# EAGLE design MOD_IO_Rev_A1 (EAGLE 6.4)
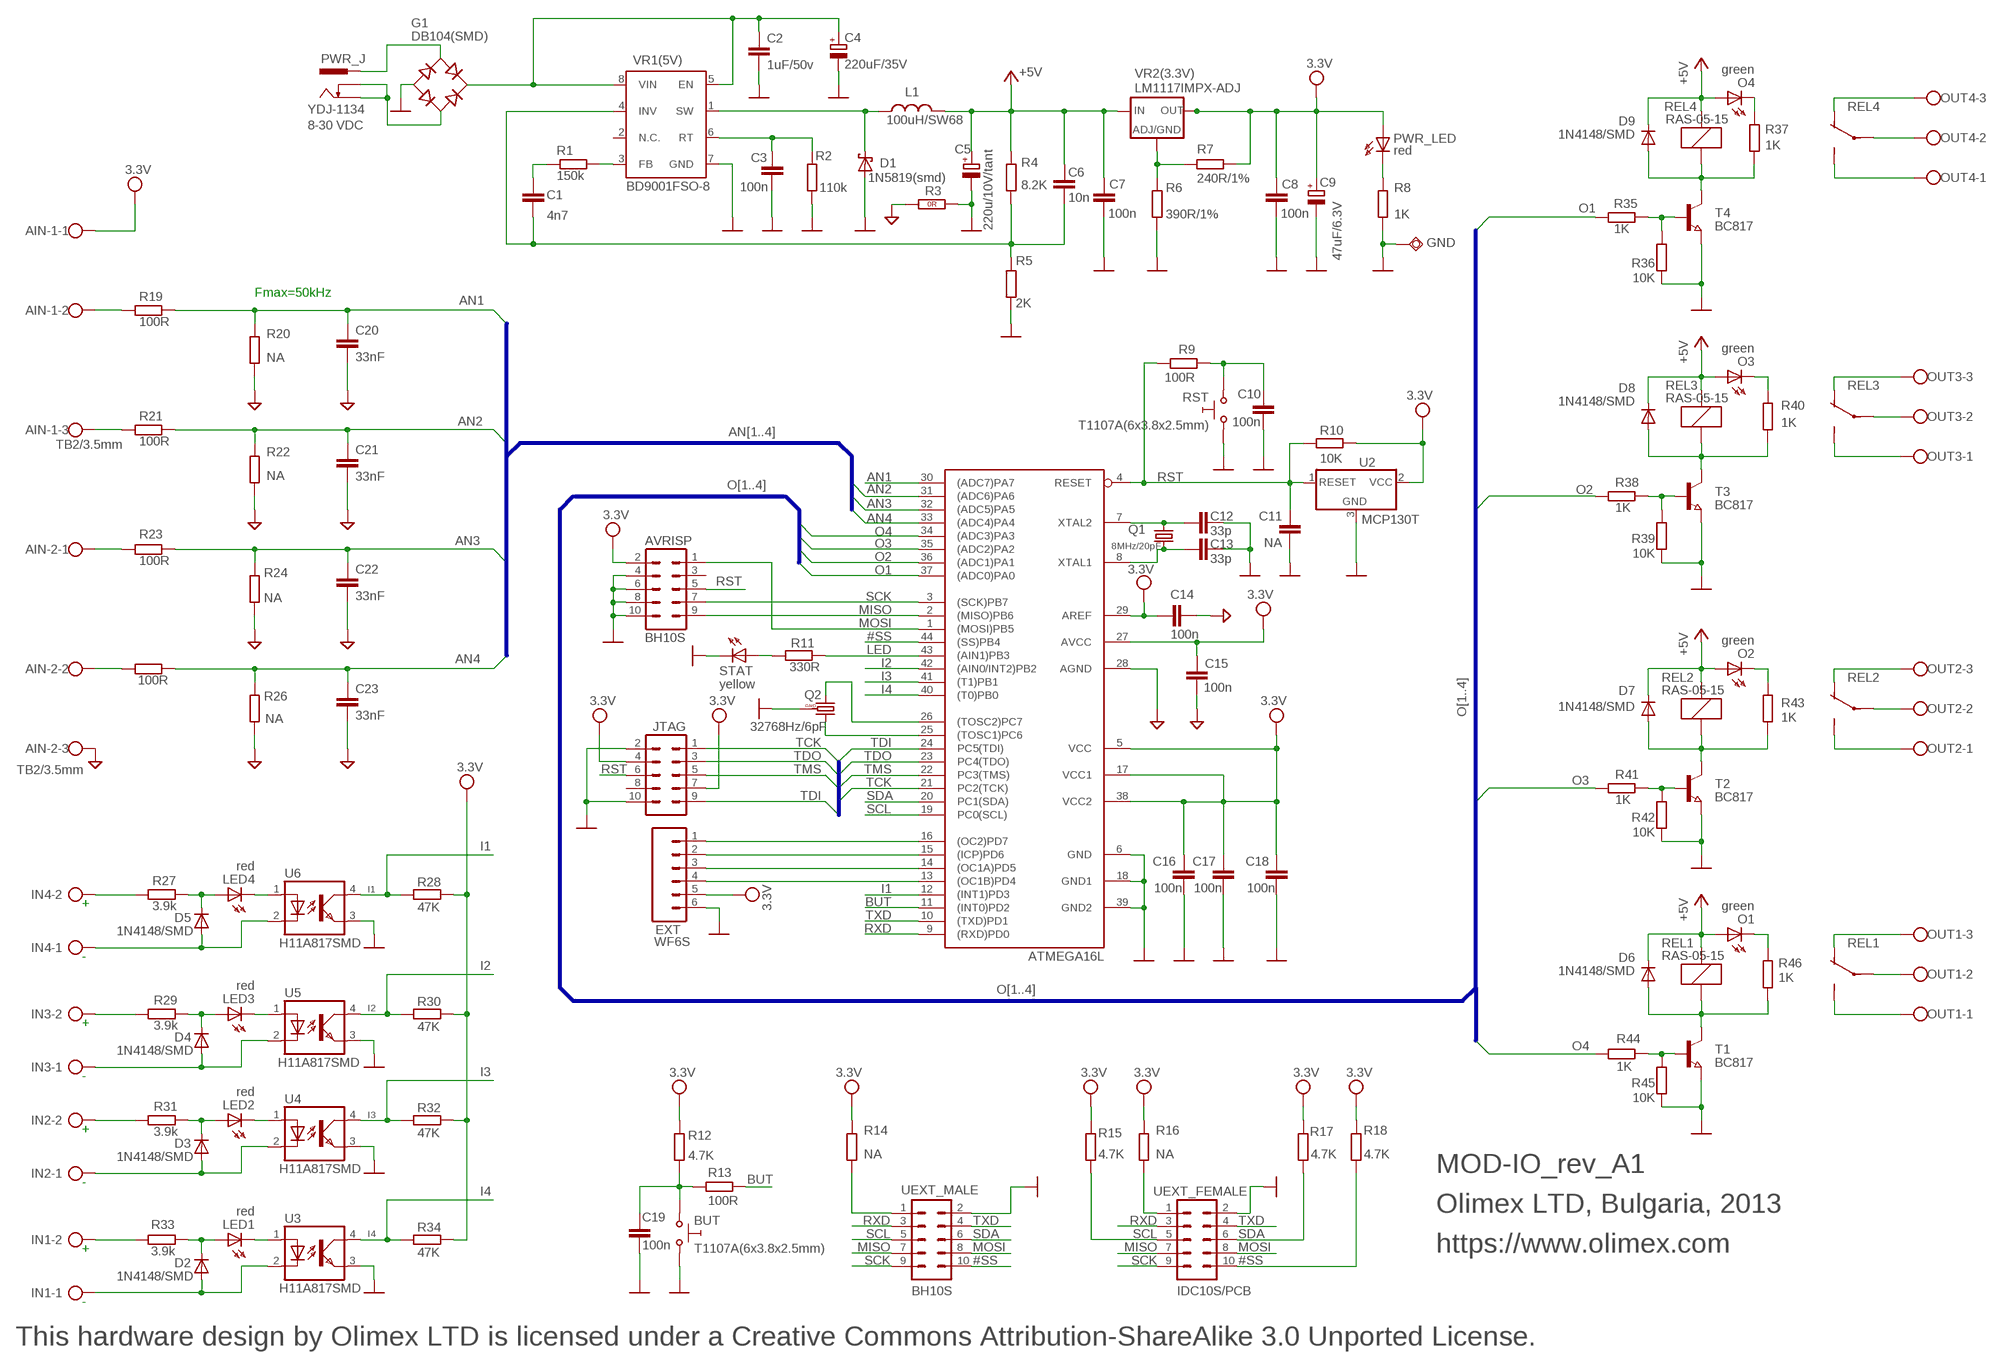
[diagram p0: schematic, sheet 1]

## Parts
AIN-1  TB2/3.5mm  W237-1034  [CON3-3.5MM]
AIN-2  TB2/3.5mm  W237-1034  [CON3-3.5MM]
AVRISP  BH10S  AVRICSP2  [CON2X5_SS2]
BUT  T1107A(6x3.8x2.5mm)  SW-TAKT6  [SW-TAKT_6X3.5_SMD]
C1  4n7  C06  [C0603]
C2  1uF/50v  C-EUC0805  [C0805]
C3  100n  C-EUC0603  [C0603]
C4  220uF/35V  CPOL-EUE3.5-8  [E3,5-8]
C5  220u/10V/tant  CPOL-EUCT7343  [CT7343]
C6  10n  C-EUC0603  [C0603]
C7  100n  C-EUC0603  [C0603]
C8  100n  C-EUC0603  [C0603]
C9  47uF/6.3V  CPOL-EUCT3528  [CT3528]
C10  100n  C-EUC0603  [C0603]
C11  NA  C-EUC0603  [C0603]
C12  33p  C-EUC0603  [C0603]
C13  33p  C-EUC0603  [C0603]
C14  100n  C-EUC0603  [C0603]
C15  100n  C-EUC0603  [C0603]
C16  100n  C-EUC0603  [C0603]
C17  100n  C-EUC0603  [C0603]
C18  100n  C-EUC0603  [C0603]
C19  100n  C-EUC0603  [C0603]
C20  33nF  C-EUC0603  [C0603]
C21  33nF  C-EUC0603  [C0603]
C22  33nF  C-EUC0603  [C0603]
C23  33nF  C-EUC0603  [C0603]
D1  1N5819(smd)  SCHOTKKY7.62SS2  [MLL-41]
D2  1N4148/SMD  DIODE-SOD80C  [SOD80C]
D3  1N4148/SMD  DIODE-SOD80C  [SOD80C]
D4  1N4148/SMD  DIODE-SOD80C  [SOD80C]
D5  1N4148/SMD  DIODE-SOD80C  [SOD80C]
D6  1N4148/SMD  DIODE-SOD80C  [SOD80C]
D7  1N4148/SMD  DIODE-SOD80C  [SOD80C]
D8  1N4148/SMD  DIODE-SOD80C  [SOD80C]
D9  1N4148/SMD  DIODE-SOD80C  [SOD80C]
EXT  WF6S  CON6PV6-2.54MM  [CON2.54MM-6-0]
G1  DB104(SMD)  B-DIL3  [DB104_SMD]
GND  TESTPAD40/70  [TESTPAD]
IN1  TB2/5MM  W237-102  [W237-102]
IN2  TB2/5MM  W237-102  [W237-102]
IN3  TB2/5MM  W237-102  [W237-102]
IN4  TB2/5MM  W237-102  [W237-102]
JTAG  BH10S  AVRICSP2  [CON2X5_SS2]
L1  100uH/SW68  LSW45  [SW68]
LED1  red  LED0805DWS  [LED-0805]
LED2  red  LED0805DWS  [LED-0805]
LED3  red  LED0805DWS  [LED-0805]
LED4  red  LED0805DWS  [LED-0805]
O1  green  LED0805DWS  [LED-0805]
O2  green  LED0805DWS  [LED-0805]
O3  green  LED0805DWS  [LED-0805]
O4  green  LED0805DWS  [LED-0805]
OUT1  TB3/5MM  W237-103  [W237-103]
OUT2  TB3/5MM  W237-103  [W237-103]
OUT3  TB3/5MM  W237-103  [W237-103]
OUT4  TB3/5MM  W237-103  [W237-103]
PWR_J  YDJ-1134  PWR-JAK3  [PWR_JACK_UNI]
PWR_LED  red  LED0805DWS  [LED-0805]
Q1  8MHz/20pF  HC49/S1  [HC49/SMD2_THIN]
Q2  32768Hz/6pF  Q_GND  [TC26H_3_REPAIR]
R1  150k  R-EU_R0603  [R0603]
R2  110k  R-EU_R0603  [R0603]
R3  R_0R0R(NA)  [0603_0R]
R4  8.2K  R-EU_R0603  [R0603]
R5  2K  R-EU_R0603  [R0603]
R6  390R/1%  R-EU_R0603  [R0603]
R7  240R/1%  R-EU_R0603  [R0603]
R8  1K  R-EU_R0603  [R0603]
R9  100R  R-EU_R0603  [R0603]
R10  10K  R-EU_R0603  [R0603]
R11  330R  R-EU_R0603  [R0603]
R12  4.7K  R-EU_R0603  [R0603]
R13  100R  R-EU_R0603  [R0603]
R14  NA  R-EU_NA  [R0603_NA]
R15  4.7K  R-EU_R0603  [R0603]
R16  NA  R-EU_NA  [R0603_NA]
R17  4.7K  R-EU_R0603  [R0603]
R18  4.7K  R-EU_R0603  [R0603]
R19  100R  R-EU_R0603  [R0603]
R20  NA  R-EU_NA  [R0603_NA]
R21  100R  R-EU_R0603  [R0603]
R22  NA  R-EU_NA  [R0603_NA]
R23  100R  R-EU_R0603  [R0603]
R24  NA  R-EU_NA  [R0603_NA]
R25  100R  R-EU_R0603  [R0603]
R26  NA  R-EU_NA  [R0603_NA]
R27  3.9k  R-EU_R0603  [R0603]
R28  47K  R-EU_R0603  [R0603]
R29  3.9k  R-EU_R0603  [R0603]
R30  47K  R-EU_R0603  [R0603]
R31  3.9k  R-EU_R0603  [R0603]
R32  47K  R-EU_R0603  [R0603]
R33  3.9k  R-EU_R0603  [R0603]
R34  47K  R-EU_R0603  [R0603]
R35  1K  R-EU_R0603  [R0603]
R36  10K  R-EU_R0603  [R0603]
R37  1K  R-EU_R0603  [R0603]
R38  1K  R-EU_R0603  [R0603]
R39  10K  R-EU_R0603  [R0603]
R40  1K  R-EU_R0603  [R0603]
R41  1K  R-EU_R0603  [R0603]
R42  10K  R-EU_R0603  [R0603]
R43  1K  R-EU_R0603  [R0603]
R44  1K  R-EU_R0603  [R0603]
R45  10K  R-EU_R0603  [R0603]
R46  1K  R-EU_R0603  [R0603]
REL1  RAS-05-15  RELAYH200F  [H200-FAT]
REL2  RAS-05-15  RELAYH200F  [H200-FAT]
REL3  RAS-05-15  RELAYH200F  [H200-FAT]
REL4  RAS-05-15  RELAYH200F  [H200-FAT]
RST  T1107A(6x3.8x2.5mm)  SW-TAKT6  [SW-TAKT_6X3.5_SMD]
STAT  yellow  LED0805DWS  [LED-0805]
T1  BC817  NPN-TRANSISTOR_SOT23  [SOT23]
T2  BC817  NPN-TRANSISTOR_SOT23  [SOT23]
T3  BC817  NPN-TRANSISTOR_SOT23  [SOT23]
T4  BC817  NPN-TRANSISTOR_SOT23  [SOT23]
U1  ATMEGA16L  ATMEGA16  [44TQFP]
U2  MCP130T  RESETMCP130T-300-I/TT  [SOT23]
U3  H11A817SMD  [OPTOCOUPLER_SMD4PIN]
U4  H11A817SMD  [OPTOCOUPLER_SMD4PIN]
U5  H11A817SMD  [OPTOCOUPLER_SMD4PIN]
U6  H11A817SMD  [OPTOCOUPLER_SMD4PIN]
UEXT_FEMALE  IDC10S/PCB  ML10SMD_1  [ML10L_PADS_FEMAIL]
UEXT_MALE  BH10S  ML10SMD  [ML10_PADS]
VR1(5V)  BD9001FSO-8  [SO-8]
VR2(3.3V)  LM1117IMPX-ADJ  LM1117  [SOT223]

## Nets
#SS: R18.1 U1.44((SS)PB4) UEXT_FEMALE.10 UEXT_MALE.10
+5V: C5.+ C6.1 C7.2 D6.C D7.C D8.C D9.C L1.2 O1.A O2.A O3.A O4.A R4.1 REL1.1 REL2.1 REL3.1 REL4.1 VR2(3.3V).3(IN)
AGND: AIN-2.3 C14.2 C15.1 C20.2 C21.2 C22.2 C23.2 R3.1(1.1) R20.1 R22.1 R24.1 R26.1 U1.28(AGND)
AN1: C20.1 R19.2 R20.2 U1.30((ADC7)PA7)
AN2: C21.1 R21.2 R22.2 U1.31((ADC6)PA6)
AN3: C22.1 R23.2 R24.2 U1.32((ADC5)PA5)
AN4: C23.1 R25.1 R26.2 U1.33((ADC4)PA4)
BUT: R13.2 U1.11((INT0)PD2)
GND [pwr1]: AVRISP.4 AVRISP.6 AVRISP.8 AVRISP.10 BUT.P$1 C2.2 C3.1 C4.- C5.- C7.1 C8.1 C9.- C10.2 C11.2 C12.1 C13.1 C16.2 C17.2 C18.2 C19.2 D1.A EXT.6 G1.- GND.P$1(PP) JTAG.2 JTAG.10 Q2.GND R2.2 R3.2(1.2) R5.2 R6.2 R8.2 R36.1 R39.1 R42.1 R45.1 RST.P$1 STAT.C T1.2(E) T2.2(E) T3.2(E) T4.2(E) U1.6(GND) U1.18(GND1) U1.39(GND2) U2.3(GND) U3.3(EMI) U4.3(EMI) U5.3(EMI) U6.3(EMI) UEXT_FEMALE.2 UEXT_MALE.2 VR1(5V).7(GND)
I1: R28.1 U1.12((INT1)PD3) U6.4(COL)
I2: R30.1 U1.42((AIN0/INT2)PB2) U5.4(COL)
I3: R32.1 U1.41((T1)PB1) U4.4(COL)
I4: R34.1 U1.40((T0)PB0) U3.4(COL)
LED: R11.1 U1.43((AIN1)PB3)
MISO: AVRISP.9 U1.2((MISO)PB6) UEXT_FEMALE.7 UEXT_MALE.7
MOSI: AVRISP.1 U1.1((MOSI)PB5) UEXT_FEMALE.8 UEXT_MALE.8
N$1: BUT.P$2 C19.1 R12.2 R13.1
N$2 [pwr1]: R16.1 UEXT_FEMALE.1
N$3: OUT2.2 REL2.P(CONTACTS:P)
N$4: OUT2.1 REL2.S(CONTACTS:S)
N$5 [rel]: OUT4.3 REL4.O(CONTACTS:O)
N$6: OUT1.2 REL1.P(CONTACTS:P)
N$7: OUT1.1 REL1.S(CONTACTS:S)
N$8: IN4.2 R27.1
N$9: IN3.2 R29.1
N$10: IN2.2 R31.1
N$11: IN1.2 R33.1
N$12 [pwr1]: R14.1 UEXT_MALE.1
N$13: EXT.1 U1.16((OC2)PD7)
N$14: C10.1 R9.1 RST.P$2
N$18: OUT4.2 REL4.P(CONTACTS:P)
N$19: OUT4.1 REL4.S(CONTACTS:S)
N$20: R35.2 R36.2 T4.1(B)
N$21 [rel]: OUT3.3 REL3.O(CONTACTS:O)
N$22 [pwr2]: D9.A R37.1 REL4.2 T4.3(C)
N$23: OUT3.2 REL3.P(CONTACTS:P)
N$24: OUT3.1 REL3.S(CONTACTS:S)
N$25: R38.2 R39.2 T3.1(B)
N$26: O4.C R37.2
N$27: O3.C R40.2
N$28: C12.2 Q1.2 U1.7(XTAL2)
N$29 [rel]: OUT2.3 REL2.O(CONTACTS:O)
N$30: EXT.2 U1.15((ICP)PD6)
N$31: EXT.3 U1.14((OC1A)PD5)
N$32: R41.2 R42.2 T2.1(B)
N$33: O1.C R46.2
N$34 [pwr2]: D8.A R40.1 REL3.2 T3.3(C)
N$35: EXT.4 U1.13((OC1B)PD4)
N$37: OUT1.3 REL1.O(CONTACTS:O)
N$38: R44.2 R45.2 T1.1(B)
N$39: C1.1 C6.2 R4.2 R5.1 VR1(5V).4(INV)
N$40: O2.C R43.2
N$43 [pwr2]: D7.A R43.1 REL2.2 T2.3(C)
N$44 [pwr2]: D6.A R46.1 REL1.2 T1.3(C)
N$46: R1.1 VR1(5V).3(FB)
N$47: R11.2 STAT.A
N$48: G1.AC1 PWR_J.- PWR_J.--
N$50: G1.AC2 PWR_J.+
N$52: AIN-1.2 R19.1
N$53: C13.2 Q1.1 U1.8(XTAL1)
N$55: AIN-2.2 R25.2
N$56: C1.2 R1.2
N$57: R6.1 R7.1 VR2(3.3V).1(ADJ/GND)
N$58: AIN-1.3 R21.1
N$59: PWR_LED.C R8.1
N$60: AIN-2.1 R23.1
N$61: C2.1 C4.+ G1.+ VR1(5V).5(EN) VR1(5V).8(VIN)
N$62: C3.2 R2.1 VR1(5V).6(RT)
N$63: D4.A IN3.1 U5.2(C)
N$65: LED3.C U5.1(A)
N$66: D5.C LED4.A R27.2
N$67: D5.A IN4.1 U6.2(C)
N$69 [pwr1]: D1.K(C) L1.1 VR1(5V).1(SW)
N$70: LED4.C U6.1(A)
N$71: D4.C LED3.A R29.2
N$72: D2.A IN1.1 U3.2(C)
N$73: Q2.1 U1.26((TOSC2)PC7)
N$74: LED1.C U3.1(A)
N$75: D3.C LED2.A R31.2
N$76: D3.A IN2.1 U4.2(C)
N$77: Q2.2 U1.25((TOSC1)PC6)
N$78: LED2.C U4.1(A)
N$79: D2.C LED1.A R33.2
O1: R35.1 U1.37((ADC0)PA0)
O2: R38.1 U1.36((ADC1)PA1)
O3: R41.1 U1.35((ADC2)PA2)
O4: R44.1 U1.34((ADC3)PA3)
RST: AVRISP.5 C11.1 JTAG.6 R9.2 R10.2 U1.4(RESET) U2.1(RESET)
RXD: U1.9((RXD)PD0) UEXT_FEMALE.3 UEXT_MALE.3
SCK: AVRISP.7 U1.3((SCK)PB7) UEXT_FEMALE.9 UEXT_MALE.9
SCL: R15.1 U1.19(PC0(SCL)) UEXT_FEMALE.5 UEXT_MALE.5
SDA: R17.1 U1.20(PC1(SDA)) UEXT_FEMALE.6 UEXT_MALE.6
TCK: JTAG.1 U1.21(PC2(TCK))
TDI: JTAG.9 U1.24(PC5(TDI))
TDO: JTAG.3 U1.23(PC4(TDO))
TMS: JTAG.5 U1.22(PC3(TMS))
TXD: U1.10((TXD)PD1) UEXT_FEMALE.4 UEXT_MALE.4
VCC [pwr1]: AIN-1.1 AVRISP.2 C8.2 C9.+ C14.1 C15.2 C16.1 C17.1 C18.1 EXT.5 JTAG.4 JTAG.7 PWR_LED.A R7.2 R10.1 R12.1 R14.2 R15.2 R16.2 R17.2 R18.2 R28.2 R30.2 R32.2 R34.2 U1.5(VCC) U1.17(VCC1) U1.27(AVCC) U1.29(AREF) U1.38(VCC2) U2.2(VCC) VR2(3.3V).2(OUT) VR2(3.3V).4(RAD) ; supply symbol labelled 3.3V
Unconnected: AVRISP.3 JTAG.8 VR1(5V).2(N.C.)

## Buses
AN[1..4]
O[1..4]
PC[0..7]

## Notes on the sheet
- 8-30 VDC
- Fmax=50kHz
- +
- -
- +
- -
- +
- MOD-IO_rev_A1
- -
- Olimex LTD, Bulgaria, 2013
- + | https://www.olimex.com
- -
- This hardware design by Olimex LTD is licensed under a Creative Commons Attribution-ShareAlike 3.0 Unported License.

## Library data of the parts
AIN-1 AIN-2 OUT1-OUT4 = con-wago-500:W237-103: WAGO SCREW CLAMP
AVRISP JTAG = gogo:AVRICSP
BUT RST = gogo:SW-TAKT
C1 = DOUBLE-SIDE:C: Capacitor
C2 C3 C6-C8 C10-C23 = rcl:C-EU: CAPACITOR, European symbol
C4 C5 C9 = rcl:CPOL-EU: POLARIZED CAPACITOR, European symbol
D1 = gogo:SCHOTKKY7.62SS
D2-D9 = diode:DIODE-: DIODE
EXT = DOUBLE-SIDE:CON6: CONNECTORS - 6 PINS
G1 = DOUBLE-SIDE:B-DIL: RECTIFIER
GND = gogo:TESTPAD: drill 40mils, diameter 70mils
IN1-IN4 = con-wago-500:W237-102: WAGO SCREW CLAMP
L1 = SINGLE-SIDE:L
LED1-LED4 O1-O4 PWR_LED STAT = DOUBLE-SIDE:LED
PWR_J = gogo:PWR-JAK
Q1 = crystal:HC49/S: CRYSTAL
Q2 = crystal:Q_GND
R1 R2 R4-R46 = rcl:R-EU_: RESISTOR, European symbol
R3 = OLIMEX_DISCRET:R_0R
REL1-REL4 = SINGLE-SIDE:RELAY: RELAY
T1-T4 = semicon-smd-ipc:NPN-TRANSISTOR_: NPN TRANSISTOR
U1 = gogo:ATMEGA16
U2 = gogo:RESET: Microcontroller Supervisory Circuit with Open Drain Output
U3-U6 = OLIMEX_DISCRET:H11A817
UEXT_FEMALE UEXT_MALE = con-harting-ml:ML10: HARTING
VR1(5V) = OLIMEX_IC:BD9001F
VR2(3.3V) = arm:LM1117

## Net classes
0 default: width 0.254 mm
1 pwr1: width 0.508 mm
2 pwr2: width 0.508 mm
3 rel: width 2.54 mm

## Board
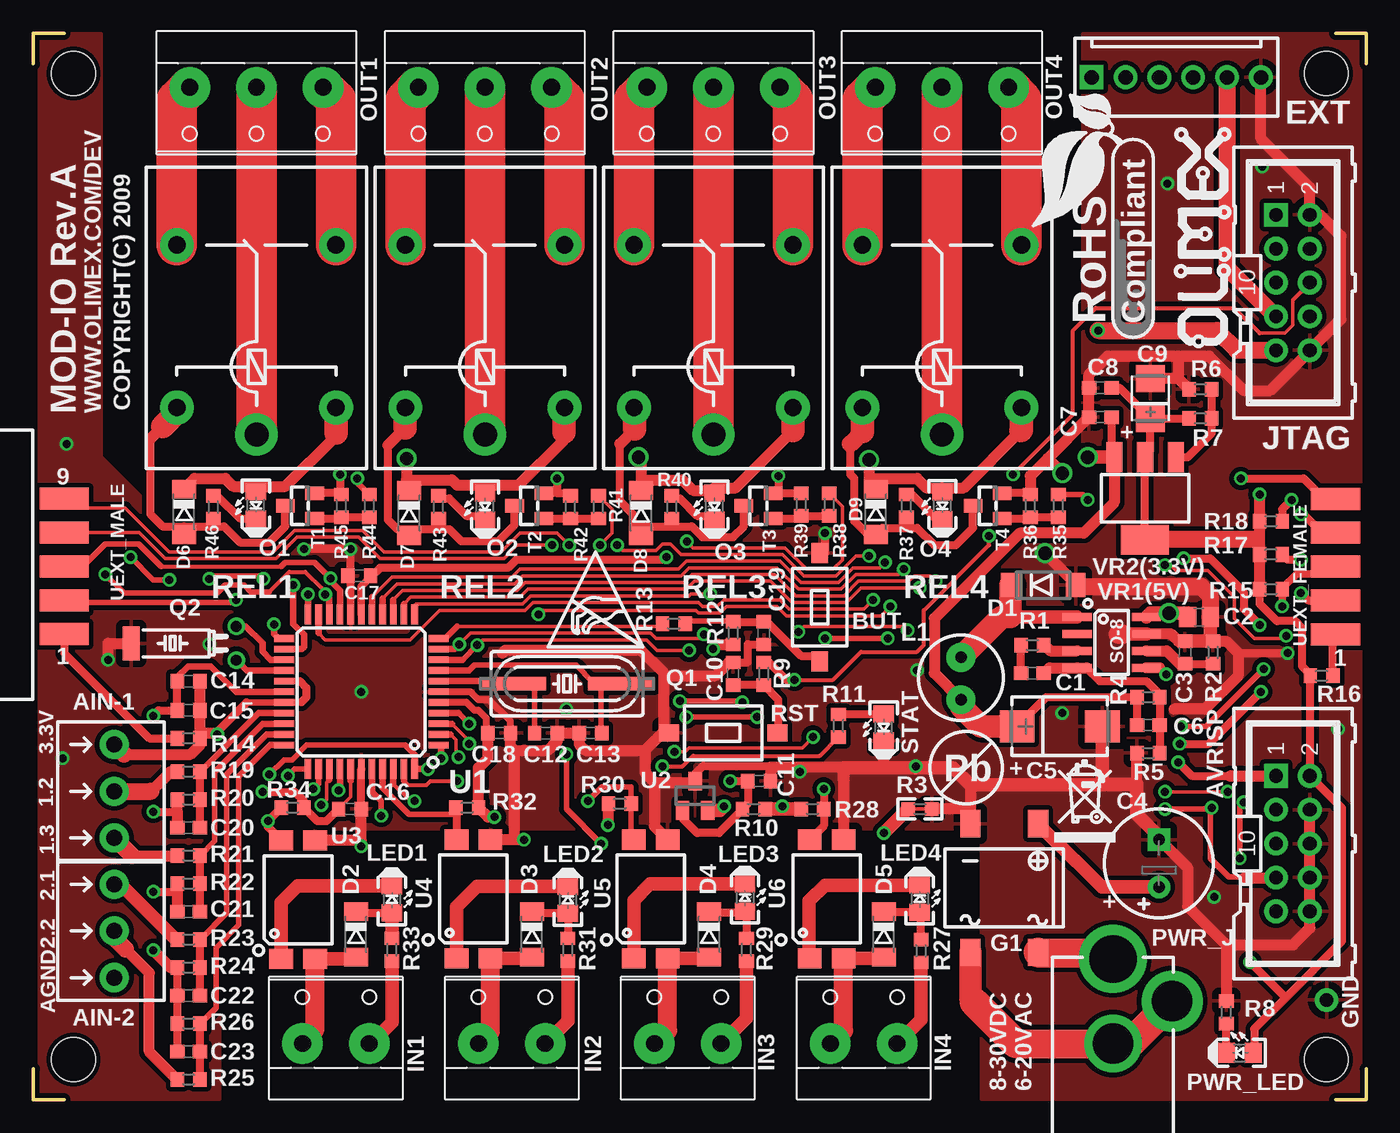
[diagram p1: board, top side]
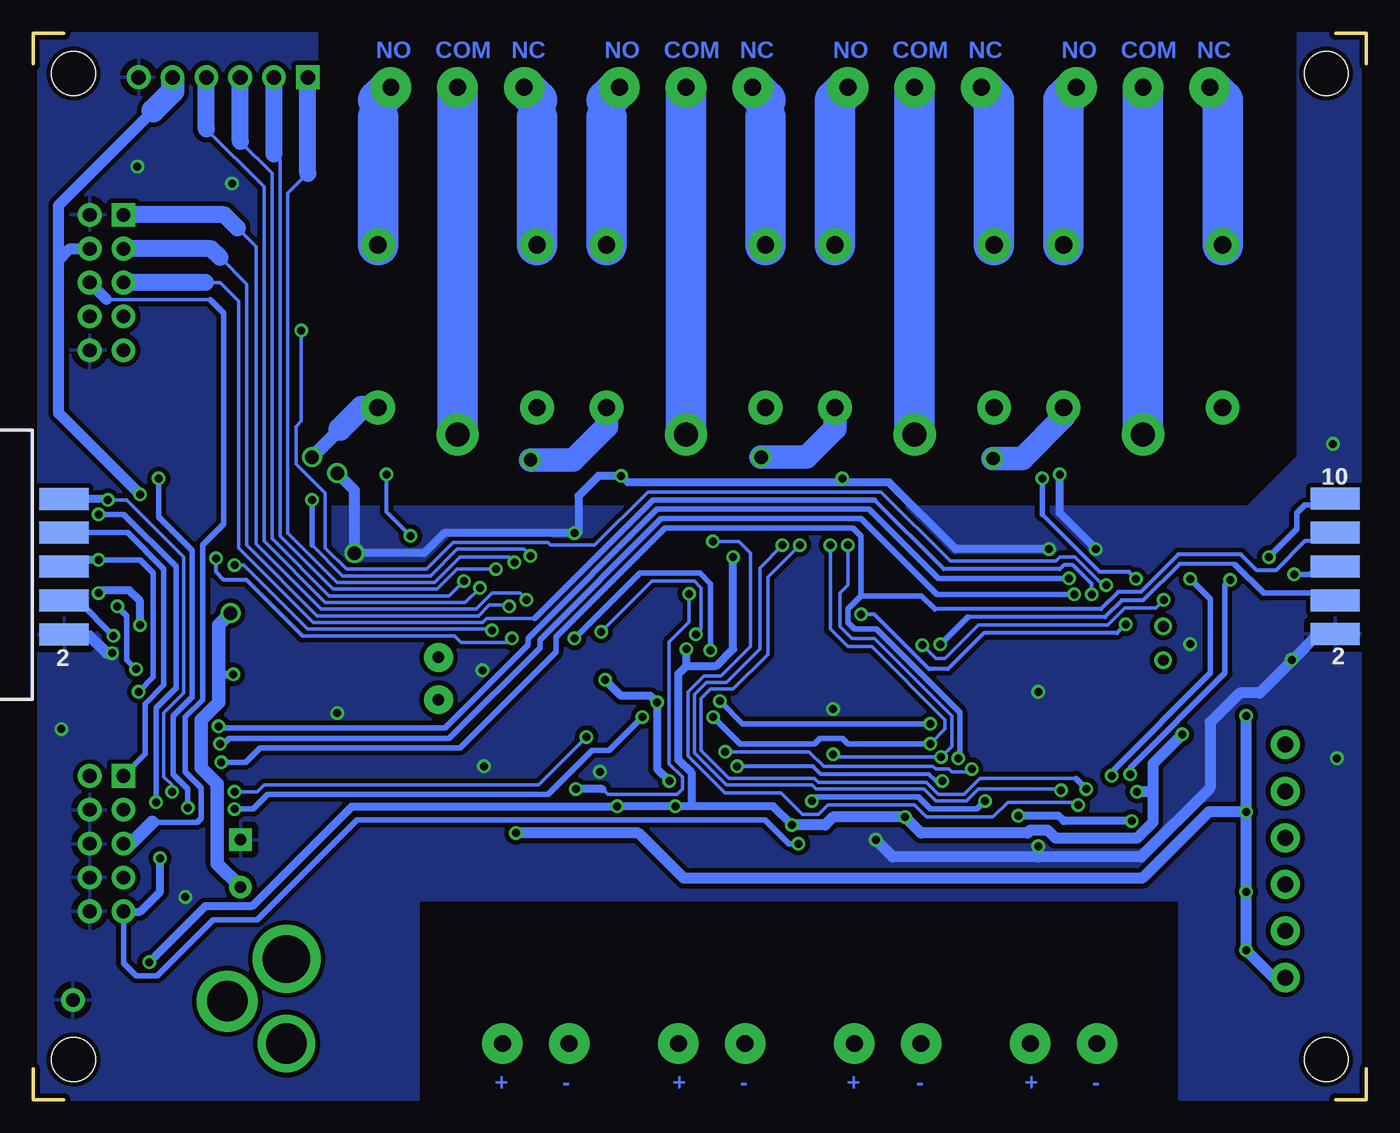
[diagram p2: board, bottom side, seen from below]

Size 100 x 80 mm. Coordinates in mm from the lower left corner, seen from the top.
Outline: 2.3,80 0,80 0,77.7
Outline: 0,2.3 0,0 2.3,0
Outline: 97.7,0 100,0 100,2.3
Outline: 97.7,80 100,80 100,77.7
Copper layers (1+16): Top 0.035mm / dielectric 1.5mm / Bottom 0.035mm
Design rules "default": minimum track width 10mil, minimum drill 0.6mm, track to track 0.24mm, track to pad 0.24mm, pad to pad 0.24mm, via to via 0.25mm, smd to smd 1mil, copper to edge 10mil, drill to drill 8mil, minimum pad ring 10mil, minimum via ring 8mil, stop-mask expansion 4mil, vias tented up to drill 25mil, thermal gap 20mil
Holes 3.3 mm at 3,77 3,3 97,3 97,77

### Footprints (pad centres in the part's own frame; a part is rotated, then mirrored left to right if it is on the bottom)
CON3-3.5MM = drill 1.2 pad 2.184: 1 -3.5,0; 2 0,0; 3 3.5,0
CON2X5_SS2 = drill 1.016 pad 1.778 square: 1 -5.08,-1.27 | drill 1.016 pad 1.778: 2 -5.08,1.27; 3 -2.54,-1.27; 4 -2.54,1.27; 5 0,-1.27; 6 0,1.27; 7 2.54,-1.27; 8 2.54,1.27; 9 5.08,-1.27; 10 5.08,1.27
SW-TAKT_6X3.5_SMD = smd 1.27 x 1.524: P$1 0,4.064; P$2 0,-4.064
C0603 = smd 1.1 x 1: 1 -0.85,0; 2 0.85,0
C0805@1 = smd 1.3 x 1.5: 1 -0.85,0; 2 0.85,0
C0603' = smd 1 x 1.1: 1 -0.85,0; 2 0.85,0
E3,5-8 = drill 0.864 pad 1.676: + -1.778,0 | drill 0.864 pad 1.676 square: - 1.778,0
CT7343 = smd 2.6 x 2.4: + -3.2,0; - 3.2,0
C0603@1 = smd 1.1 x 1: 1 -0.85,0; 2 0.85,0
CT3528 = smd 2 x 2.2: + -1.5,0; - 1.5,0
MLL-41 = smd 1.45 x 1.8: A 2.445,0; K -2.445,0
SOD80C = smd 1.4 x 1.8: A 1.7,0; C -1.7,0
CON2.54MM-6-0 = drill 1.092 pad 1.778 square: 1 -6.35,0 | drill 1.092 pad 1.778: 2 -3.81,0; 3 -1.27,0; 4 1.27,0; 5 3.81,0; 6 6.35,0
DB104_SMD = smd 1.524 x 2.032: + -2.54,-4.826; - 2.54,-4.826; AC1 2.54,4.826; AC2 -2.54,4.826
TESTPAD = drill 1.016 pad 1.778: P$1 0,0
W237-102 = drill 1.27 pad 3.048: 1 -2.5,-1.27; 2 2.5,-1.27
SW68 = drill 0.864 pad 2.159: 1 0,0; 2 3.175,0
LED-0805 = smd 1.27 x 1.524: A 1.016,0; C -1.016,0
W237-103 = drill 1.27 pad 3.048: 1 -5,-1.29; 2 0,-1.29; 3 5,-1.29
PWR_JACK_UNI = drill 3.556 pad 5.08: + -0.127,4.826 | drill 3.048 pad 4.318: - -6.477,4.826 | drill 3.048 pad 4.572: -- -3.302,0.381
HC49/SMD2_THIN = smd 5 x 1: 1 -4.064,0; 2 4.064,0
TC26H_3_REPAIR = drill 0.813: 1 -1.27,0; 2 1.27,0 | smd 2.54 x 1.27: GND 0,7.874
R0603 = smd 1 x 1.1: 1 -0.85,0; 2 0.85,0
0603_0R = smd 1.016 x 1.016: 1 -0.889,0; 2 0.889,0
R0603_NA = smd 1 x 1.1: 1 -0.85,0; 2 0.85,0
H200-FAT = drill 1.295 pad 2.54: 1 -7.493,-5.969; 2 -7.493,5.969; O 4.699,5.969; S 4.699,-5.969 | drill 1.803 pad 3.175: P -9.525,0
SOT23 = smd 1 x 1.4: 1 -0.95,-1.1; 2 0.95,-1.1; 3 0,1.1
44TQFP = smd 1.5 x 0.5: 1 -5.8,4; 2 -5.8,3.2; 3 -5.8,2.4; 4 -5.8,1.6; 5 -5.8,0.8; 6 -5.8,0; 7 -5.8,-0.8; 8 -5.8,-1.6; 9 -5.8,-2.4; 10 -5.8,-3.2; 11 -5.8,-4; 23 5.8,-4; 24 5.8,-3.2; 25 5.8,-2.4; 26 5.8,-1.6; 27 5.8,-0.8; 28 5.8,0; 29 5.8,0.8; 30 5.8,1.6; 31 5.8,2.4; 32 5.8,3.2; 33 5.8,4 | smd 0.5 x 1.5: 12 -4,-5.8; 13 -3.2,-5.8; 14 -2.4,-5.8; 15 -1.6,-5.8; 16 -0.8,-5.8; 17 0,-5.8; 18 0.8,-5.8; 19 1.6,-5.8; 20 2.4,-5.8; 21 3.2,-5.8; 22 4,-5.8; 34 4,5.8; 35 3.2,5.8; 36 2.4,5.8; 37 1.6,5.8; 38 0.8,5.8; 39 0,5.8; 40 -0.8,5.8; 41 -1.6,5.8; 42 -2.4,5.8; 43 -3.2,5.8; 44 -4,5.8
OPTOCOUPLER_SMD4PIN = smd 1.778 x 1.524: 1 -1.27,-4.445; 2 1.27,-4.445; 3 1.27,4.445; 4 -1.27,4.445
ML10L_PADS_FEMAIL = smd 1.651 x 3.683 bottom: 1 -5.093,-3.404; 3 -2.553,-3.404; 5 -0.013,-3.404; 7 2.527,-3.404; 9 5.067,-3.404 | smd 1.651 x 3.683: 2 -5.093,-3.404; 4 -2.553,-3.404; 6 -0.013,-3.404; 8 2.527,-3.404; 10 5.067,-3.404
ML10_PADS = smd 1.651 x 3.683: 1 -5.08,-0.229; 3 -2.54,-0.229; 5 0,-0.229; 7 2.54,-0.229; 9 5.08,-0.229 | smd 1.651 x 3.683 bottom: 2 -5.08,-0.229; 4 -2.54,-0.229; 6 0,-0.229; 8 2.54,-0.229; 10 5.08,-0.229
SO-8 = smd 0.6 x 2.2: 1 -1.905,-2.6; 2 -0.635,-2.6; 3 0.635,-2.6; 4 1.905,-2.6; 5 1.905,2.6; 6 0.635,2.6; 7 -0.635,2.6; 8 -1.905,2.6
SOT223 = smd 1.219 x 2.235: 1 -2.311,-3.099; 2 0,-3.099; 3 2.311,-3.099 | smd 3.6 x 2.2: 4 0,3.099

### Placement (x,y rotation side)
AIN-1  6.07,23.13 270 top
AIN-2  6.08,12.65 270 top
AVRISP  94.5,19.2 270 top
BUT  59,36.94 0 top
C1  74.95,32 180 top
C2  1uF/50v  [C0805@1]  87.45,36.2 0 top
C3  100n  [C0603']  86.4,33.55 270 top
C4  84.45,17.72 90 top
C5  77,28 0 top
C6  10n  [C0603@1]  83.65,28.1 0 top
C7  100n  [C0603@1]  80.05,51.2 0 top
C8  100n  [C0603@1]  80.05,53.4 0 top
C9  83.8,52.6 90 top
C10  100n  [C0603']  52.5,31.95 90 top
C11  NA  [C0603']  54.45,23.9 0 top
C12  33p  [C0603']  38.45,27.5 180 top
C13  33p  [C0603']  41.8,27.5 0 top
C14  100n  [C0603']  11.65,31.4 180 top
C15  100n  [C0603']  11.65,29.2 0 top
C16  100n  [C0603']  23.75,21.8 0 top
C17  100n  [C0603']  24.45,39.3 180 top
C18  100n  [C0603']  34.95,27.5 0 top
C19  100n  [C0603']  54.8,35 270 top
C20  33nF  [C0603@1]  11.65,20.4 180 top
C21  33nF  [C0603@1]  11.65,14.1 180 top
C22  33nF  [C0603@1]  11.65,7.8 180 top
C23  33nF  [C0603@1]  11.65,3.6 180 top
D1  75.75,38.6 0 top
D2  24.2,12.4 270 top
D3  37.4,12.4 270 top
D4  50.7,12.4 270 top
D5  63.8,12.4 270 top
D6  11.3,44.1 270 top
D7  28.2,44 270 top
D8  45.6,44 270 top
D9  63.2,44.1 270 top
EXT  85.75,76.7 0 top
G1  72.84,15.87 180 top
GND  97.03,7.47 0 top
IN1  22.7,5.47 0 top
IN2  35.9,5.47 0 top
IN3  49.1,5.47 0 top
IN4  62.3,5.47 0 top
JTAG  94.5,61.3 270 top
L1  69.6,33.17 270 top
LED1  26.9,15.02 270 top
LED2  40.1,14.98 270 top
LED3  53.4,15.15 270 top
LED4  66.5,15.07 270 top
O1  16.7,44.58 90 top
O2  33.9,44.5 90 top
O3  51.1,44.5 90 top
O4  68.2,44.55 90 top
OUT1  16.74,74.66 180 top
OUT2  33.88,74.66 180 top
OUT3  51.03,74.66 180 top
OUT4  68.17,74.66 180 top
PWR_J  85.83,10.68 90 top
PWR_LED  90.52,3.5 0 top
Q1  40.04,31.2 180 top
Q2  15.23,34.23 90 top
R1  74.95,34.1 180 top
R2  88.5,33.55 90 top
R3  66.51,21.8 0 top
R4  83.65,30.2 0 top
R5  83.65,26 180 top
R6  87.55,53.3 180 top
R7  87.55,51.1 180 top
R8  89.5,6.55 90 top
R9  54.8,31.95 90 top
R10  54.05,21.8 180 top
R11  60.4,28.05 90 top
R12  52.5,35 90 top
R13  48.05,35.7 180 top
R14  11.65,27.1 0 top
R15  92.85,38.3 180 top
R16  96.65,31.8 180 top
R17  92.85,40.9 180 top
R18  92.85,43.4 180 top
R19  11.65,24.6 0 top
R20  11.65,22.5 0 top
R21  11.65,18.3 0 top
R22  11.65,16.2 0 top
R23  11.65,12 0 top
R24  11.65,9.9 0 top
R25  11.65,1.5 180 top
R26  11.65,5.7 0 top
R27  66.6,11.15 90 top
R28  58.45,21.8 180 top
R29  53.5,11.25 90 top
R30  44,22.2 180 top
R31  40.1,11.25 90 top
R32  32.55,21.9 0 top
R33  26.9,11.25 90 top
R34  19.45,21.9 0 top
R35  76.9,44.55 270 top
R36  74.8,44.55 270 top
R37  65.5,44.55 90 top
R38  59.7,44.65 270 top
R39  57.6,44.65 270 top
R40  47.9,44.45 90 top
R41  42.4,44.45 270 top
R42  40.3,44.45 270 top
R43  30.4,44.45 90 top
R44  25.2,44.55 270 top
R45  23.1,44.55 270 top
R46  13.5,44.45 90 top
REL1  16.74,59.42 90 top
REL2  33.88,59.42 90 top
REL3  51.03,59.42 90 top
REL4  68.17,59.42 90 top
RST  51.76,27.5 90 top
STAT  63.8,27.92 90 top
T1  20,44.55 90 top
T2  37.2,44.55 90 top
T3  54.4,44.55 90 top
T4  71.6,44.55 90 top
U1  24.6,30.6 180 top
U2  49.65,22.8 0 top
U3  19.87,14.99 0 top
U4  33.02,15.04 0 top
U5  46.32,15.04 0 top
U6  59.52,15.04 0 top
U$1  [RECYCLE_BIN1/8]  76.6,19.3 0 top
U$3  [ESD_SYMBOL]  38.62,33.96 0 top
U$4  [PB]  70,24.9 0 top
U$5  [ROHS]  83.4,58.2 90 top
U$6  [OLIMEX1_V]  90,74.1 90 top
UEXT_FEMALE  101.1,40 90 bottom
UEXT_MALE  2.1,40 90 top
VR1(5V)  80.9,34.3 270 top
VR2(3.3V)  83.41,45.1 180 top

### Tracks (layer width: path | path; a pad name or v marks a point on that pad's centre or on a via)
#SS  (via drill 0.6)
  Top 0.254: v48.1,26.1 48.9,26.1 49.2,26.4 57.7,26.4 v58.5,27.2 | v84.9,23.1 v89.6,23.1
  Top 0.406: v10.2,39 9,39 v7.3,40.7 | 28.6,25.9 27.9,26.6 20.5,26.6 19.4,25.5 18.8,25.5 v17.7,24.4
  Top 0.5: v29.6,24.8 U1.44 28.6,25.9
  Top 0.61: v94.4,45 93.7,44.3 R18.1
  Bottom 0.254: v94.4,45 93,45 88.7,40.7 88.7,30.5 90.2,29 90.2,24.2 89.6,23.6 v89.6,23.1 | v29.6,24.8 29.8,24.6 31.1,24.6 31.3,24.8 32.3,24.8 32.5,25 40.7,25 41.8,26.1 v48.1,26.1 | v58.5,27.2 62.1,23.6 82.7,23.6 83.2,23.1 v84.9,23.1
  Bottom 0.406: v94.4,45 94.47,45.07 | v7.3,40.7 5.2,42.8 5.2,44 4.6,44.6 2.81,44.6 UEXT_MALE.10 | v10.2,39 10.6,38.6 10.6,32 17.7,24.9 v17.7,24.4
  Bottom 0.61: 94.47,45.07 UEXT_FEMALE.10
+5V  (via drill 1, 1 pad 0.25)
  Top 0.406: VR2(3.3V).3 80.9,48.4
  Top 0.61: 73.85,28 C5.+ 76,30.2 R4.1 C6.1 | 33.9,46.1 O2.A | O4.A 68.2,45.5 | 80.9,48.4 C7.2
  Top 0.813: D6.C 12.1,46.6 14.4,46.6 15,46 16.7,46 | 39.8,50.1 39.8,49.5 36.4,46.1 33.9,46.1 31.8,46.1 31.4,46.5 28,46.5 | 51.1,45.7 O3.A | 68.2,45.9 69.8,45.9 74.1,50.2 | 16.7,46 O1.A | D7.C 28,45.7 28,46.5 | v28,48.1 28,46.5 | 45.6,46.5 D8.C | v45.4,48.2 45.6,48 45.6,46.5 | D9.C 62.7,45.8 62.7,46.6 | v62.7,48 62.7,46.6 | 68.2,45.9 O4.A | 62.7,46.6 66.3,46.6 67,45.9 68.2,45.9 | 45.6,46.5 48.7,46.5 49.5,45.7 51.1,45.7 | VR2(3.3V).3 81.1,44.8 78.8,42.5 74,42.5 67.6,36.1 67.6,32 L1.2 | 22.7,50 22.7,49.8 18.9,46 16.7,46 | 51.1,45.7 51.1,45.9 52.7,45.9 57,50.2
  Top 1.016: v79.1,48.2 VR2(3.3V).3
  Top 1.27: 39.8,51.87 REL2.1
  Top 1.676: L1.2 69.6,29.5 71.1,28 C5.+
  Top 1.778: 39.8,50.1 39.8,51.87 | REL4.1 74.14,50.24 74.1,50.2 | REL3.1 57,50.2 | 22.7,50 22.7,50.4 22.71,50.41 REL1.1
  Bottom 1.016: 77,50.3 v79.1,48.2
  Bottom 1.778: REL2.1 39.85,50.35 42,48.2 v45.4,48.2 | REL4.1 75.37,51.93 77,50.3 | REL1.1 22.71,51.19 25.8,48.1 v28,48.1 | REL3.1 57,50.5 59.5,48 v62.7,48
AGND  (via drill 0.6, 0.6 pad 0.25)
  Top 0.5: C14.2 10.8,31.7 11.6,32.5 13.3,32.5 15.2,30.6 U1.28
  Top 0.61: C23.2 R26.1 C22.2 R24.1 | v9,21.6 10.8,21.6 | v9,15.6 10.8,15.6 | C14.2 C15.1 9.4,29.2 v9,28.8
  Top 0.813: R20.1 10.8,21.6 C20.2 | C21.2 10.8,15.6 R22.1 | R24.1 10.3,9.9 v9,11.2
  Top 1.016: R3.1 65.6,21.8 v63.8,20
  Bottom 0.813: v9,21.6 v9,15.6 v9,11.2 6.95,9.15 AIN-2.3 | v9,21.6 v9,28.8 | v9,21.6 11.8,21.6 16.8,16.6 51.2,16.6 54.6,20 v63.8,20
AN1
  Top 0.406: R19.2 16.9,29
  Top 0.5: 16.9,29 U1.30
  Top 0.61: R19.2 R20.2 C20.1
AN2
  Top 0.406: R21.2 13.6,19.4 13.6,24.6 17.2,28.2
  Top 0.5: 17.2,28.2 U1.31
  Top 0.61: R21.2 R22.2 C21.1
AN3
  Top 0.406: R23.2 14.5,14 14.5,24.4 17.5,27.4
  Top 0.5: 17.5,27.4 U1.32
  Top 0.61: R23.2 R24.2 C22.1
AN4
  Top 0.406: R26.2 13.7,6.9 13.7,11.4 15.41,13.11 15.41,24.23 17.78,26.6
  Top 0.5: 17.78,26.6 U1.33
  Top 0.61: 12.5,1.4 R25.1 C23.1 R26.2
BUT
  Top 0.254: R13.2 47,35.5 31.8,35.5
  Top 0.5: U1.11 30.9,34.6 31.8,35.5
GND  (via drill 0.6, 0.6 pad 0.25, 1)
  Top 0.508: U1.6 32.8,30.6 33.4,30 34.2,30 35.8,28.4 C18.2
  Top 0.55: U1.18 23.8,39.1 C17.2
  Top 0.61: 23,45.5 T1.2 | U2.3 49.65,24.45 50.25,25.05 55.3,25.05 55.3,24.95 | R42.1 40.3,45.5 39.3,45.5 | 39.3,45.5 T2.2 | R39.1 T3.2 55.9,45.9 v55.9,46.8 | R36.1 74.8,45.5 T4.2 | C16.2 24.6,21.6 U1.39 | 88.3,34.4 R2.2 | 70.3,21.8 G1.- | v23,46.9 23,45.5 | 23,45.5 R45.1 | v39.3,46.6 39.3,45.5 | C17.2 23.8,39.5 v23.8,41.3 v20.3,41.3 | 90.4,33.5 v94.1,33.5 | v59.4,42.5 59.4,41 BUT.P$1 | C19.2 53.6,34.15 53.6,32.8 C10.2
  Top 0.813: 35.2,33.5 35.4,33.7 45.6,33.7 47.3,32 47.3,31.8 | 45.9,26.2 41.4,26.2 40.95,26.65 C13.1 C12.1 39.3,26.9 38.6,26.2 36.1,26.2 | 89.5,11.6 R8.2 | 89.5,11.6 94.5,11.6 95.77,12.87 AVRISP.10 AVRISP.8 AVRISP.6 AVRISP.4 | U6.3 60.79,24.9 60.79,23.89 60.8,23.89 60.8,24.95 55.3,24.95 C11.2 | 24.6,19.44 U3.3 | VR1(5V).7 85.37,34.93 85.9,34.4 86,34.4 | 85.6,29.3 87.9,29.3 90.4,31.8 90.4,33.5 89.5,34.4 R2.2 | EXT.6 92.1,72.1 95.77,68.43 JTAG.2 96.52,66.38 98.1,64.8 98.1,58.55 JTAG.10 95.8,56.22 95.8,56.2 92.8,53.2 90.8,53.2 88.2,55.8 85.9,55.8 | R3.2 70.3,21.8 70.3,23.6 | 36.1,26.2 35.8,26.5 C18.2 | 85.9,55.8 80.6,55.8 79.2,54.4 C8.1 C7.1 76.1,48.1 | 78.3,38.5 78.3,38.7 D1.A 78.2,39.1 77.8,39.1 v75.9,41 | 85.9,54.1 C9.- | 85.9,54.1 R6.2 | 85.9,55.8 85.9,54.1 | 74.8,45.5 74.8,46.8 76.1,48.1 | v24.6,19 24.6,19.44 | 24.6,19.44 24.6,21.6 | 89.5,11.6 86.6,14.5 86.6,17.4 84.5,19.5 C4.- | 47.3,27.5 47.2,27.5 45.9,26.2 | 63.8,24.9 STAT.C | v77.2,47 76.1,48.1 | U5.3 46.6,20.5 46.6,23.8 | 45.9,26.2 45.9,24.5 46.6,23.8 | U2.3 49.7,23.9 49.6,23.8 46.6,23.8 | 47.3,27.5 RST.P$1 | 47.3,27.5 47.3,31.8 | 36.1,19.49 U4.3 | 36.1,19.49 36.1,26.2 | v36.8,19.49 36.1,19.49 | 47.3,31.8 51.17,31.8 52.17,32.8 C10.2 | 82.8,23.65 R5.2 | v5.6,33 5.6,34.23 Q2.GND
  Top 1.016: 86,34.4 88.3,34.4 C2.2 | 60.79,24.9 63.8,24.9 69,24.9 70.3,23.6 80.3,23.6 80.35,23.65 | C5.- 80.2,23.8 80.35,23.65 | C4.- 84.45,19.75 82.8,21.4 82.8,23.65 80.35,23.65 | VR1(5V).7 81.77,34.93
  Top 1.27: 78.3,38.5 87.6,38.5 88.3,37.8 C2.2
  Top 1.422: 81.77,34.93 81.37,34.93
  Bottom 0.61: v23.8,41.3 30.8,41.3 35.8,46.3 39.3,46.3 | 39.3,46.3 55.4,46.3 v55.9,46.8 57.6,46.8 59.1,45.3 59.1,42.5 v59.4,42.5 69.2,42.5 70.7,41 v75.9,41 | 39.3,46.3 v39.3,46.6 | v20.3,41.3 23,44 v23,46.9
  Bottom 0.813: v94.1,33.5 94.5,33.5 95.8,34.8 97.59,34.8 UEXT_FEMALE.2 | v75.9,41 75.9,45.7 v77.2,47 | 24.6,18.2 16.9,18.2 11.7,23.4 11.7,28.3 9.5,30.5 8,30.5 5.5,33 | v36.8,19.49 35.51,18.2 24.6,18.2 | 24.6,18.2 v24.6,19 | UEXT_MALE.2 3.58,34.92 5.5,33 | 5.5,33 v5.6,33
  other vias: 13.21,34.16 66.2,25 40,29.3 24.6,30.6 66.3,32.2 77.2,29 88.6,15.2 57.5,24.6 92.2,70 2.5,49.2 2.2,25.6 97.9,27.8 85.09,68.73
  pour Bottom (isolate 0.356, rank 2): 13.97,14.97 13.97,0.03 0.43,0.03 0.43,79.95 5.08,79.95 5.08,48.26 8.89,44.45 78.74,44.45 78.74,79.95 99.6,79.95 99.6,0.03 71.12,0.03 71.12,14.97
  pour Top (isolate 0.356, rank 2): 13.97,20.32 13.97,0.03 0.43,0.03 0.43,79.95 5.08,79.95 5.08,48.26 8.89,44.45 78.74,44.45 78.74,79.95 99.6,79.95 99.6,0.03 71.12,0.03 71.12,20.32
I1  (via drill 0.6)
  Top 0.254: U1.12 28.6,37.1 28.7,37.2 36.7,37.2 37.3,37.8 49.2,37.8 49.35,37.95 v50.8,37.95
  Top 0.6: v59.3,23.3 59.3,21.7
  Top 0.61: U6.4 59.3,20.54 59.3,21.7 R28.1
  Bottom 0.254: v50.8,37.95 50.8,35.85 52.3,34.35 52.3,25.2 51.3,24.2 51.3,23.3 51.7,22.9 56.9,22.9 57.3,23.3
  Bottom 0.6: 57.3,23.3 v59.3,23.3
I2  (via drill 0.6)
  Top 0.305: 27,23.7 28.3,22.4 v28.6,22.4
  Top 0.406: 45.3,19.5 45.3,19.49 U5.4 45.05,19.6 45.1,19.6 44.85,19.85 R30.1 44.85,23.45 42.65,23.45 v41.6,22.4
  Top 0.5: U1.42 27,23.7
  Bottom 0.406: v28.6,22.4 29.2,21.8 32.7,21.8 33.6,22.7 41.3,22.7 v41.6,22.4
I3
  Top 0.406: 26.2,23.4 28.2,21.4 31.7,21.4 R32.1
  Top 0.5: U1.41 26.2,23.4
  Top 0.61: U4.4 31.75,21.85 R32.1
I4  (via drill 0.6)
  Top 0.406: v26.1,21.3 26.1,22.4 25.4,23.1
  Top 0.5: 25.4,23.1 U1.40
  Top 0.61: U3.4 17.6,20.44 v17.6,20.9 R34.1
  Bottom 0.61: v17.6,20.9 22.7,20.9 23.1,21.3 v26.1,21.3
LED  (via drill 0.6)
  Top 0.305: 27.8,23.9 28.1,23.6 29.5,23.6 29.8,23.9 v31.8,23.9 | R11.1 59,25.8 49.5,25.8 48.7,25 v47.2,25
  Top 0.5: U1.43 27.8,23.9
  Bottom 0.305: v47.2,25 41.5,25 40.9,24.4 32.8,24.4 32.3,23.9 v31.8,23.9
MISO  (via drill 0.6)
  Top 0.254: 31.3,27.4 31.7,27 31.7,25.9 v31.9,25.7 | UEXT_MALE.7 7.96,42.54 9.9,40.6 18.2,40.6 19.8,42.2 24.4,42.2 26,40.6 35.3,40.6 36.3,41.6 v38.9,41.6
  Top 0.406: 96.67,42.53 UEXT_FEMALE.7 | v90.5,18.1 90.5,22 v90.8,22.3 | v40,25.9 40,21.8 v42.6,19.2
  Top 0.5: 31.3,27.4 U1.2
  Top 0.61: 96.67,42.53 96.67,42.5 96.7,42.5 95.3,43.9 v95.1,43.9
  Bottom 0.254: v38.9,41.6 38.9,38.6 39.5,38 39.5,35.5 38.6,34.6 36.9,34.6 31.1,28.8 31.1,26.5 v31.9,25.7 39.8,25.7 v40,25.9
  Bottom 0.406: v95.1,43.9 93.2,43.9 89.3,40 89.3,30.9 90.8,29.4 v90.8,22.3 | v42.6,19.2 43.3,19.2 45.1,21 75.7,21 83.2,13.5 86.5,13.5 90.7,9.3 92.3,9.3 93.23,10.23 93.23,14.1 AVRISP.9
  Bottom 0.61: 93.23,14.1 92,14.1 90.5,15.6 v90.5,18.1
MOSI  (via drill 0.6)
  Top 0.254: 90.17,24.27 90.17,24.13
  Top 0.406: 90,24.3 90,24.27
  Top 0.5: U1.1 30.6,26.6 v30.6,25.6
  Top 0.61: v85.9,25.3 86.9,24.3 90,24.3
  Top 0.813: AVRISP.1 90.17,24.27 90,24.27 89.78,24.27
  Bottom 0.305: 32.36,36.8 19.9,36.8 18.6,38.1 16.9,38.1 14.1,40.9 9.4,40.9 8.2,39.7 6.8,39.7 4.6,41.9 2.97,41.9 UEXT_MALE.8
  Bottom 0.406: 93.23,24.3 91.6,25.93 91.6,29.7 90.2,31.1 90.2,39.8 92.93,42.53 UEXT_FEMALE.8 | 37.9,37.8 33.36,37.8 32.36,36.8 | v85.9,25.3 84.08,25.3 82.98,26.4 68,26.4 60.8,33.6 60.8,34.7 52.6,42.9 38.5,42.9 37.9,42.3 37.9,37.8 | 37.9,37.8 38.9,36.8 38.9,35.8 38.4,35.3 36.74,35.3 30.5,29.06 30.5,25.7 v30.6,25.6
  Bottom 0.813: AVRISP.1 93.23,24.3
N$1
  Top 0.406: R13.1 49.1,35.9 52.3,35.9 52.35,35.85 R12.2
  Top 0.61: BUT.P$2 58.57,33.3 57.6,33.3 55.2,35.7 54.8,35.7 C19.1 R12.2
N$2
  Top 0.61: R16.1 97.5,34.71 UEXT_FEMALE.1
N$3
  Top 3.048: REL2.P OUT2.2
  Bottom 3.048: REL2.P OUT2.2
N$4
  Top 3.048: REL2.S 39.85,74.98 OUT2.1
  Bottom 3.048: REL2.S 39.85,74.98 OUT2.1
N$5
  Top 3.048: REL4.O 62.21,74.98 OUT4.3
  Bottom 3.048: REL4.O 62.21,73.71 | OUT4.3 62.21,74.98
N$6
  Top 3.048: REL1.P OUT1.2
  Bottom 3.048: REL1.P OUT1.2
N$7
  Top 3.048: REL1.S 22.71,74.98 OUT1.1
  Bottom 3.048: OUT1.1 22.71,74.98 REL1.S
N$8
  Top 1.016: R27.1 66.6,6 IN4.2
N$9
  Top 1.016: R29.1 53.5,6.1 IN3.2
N$10
  Top 1.016: R31.1 40.1,5.9 IN2.2
N$11
  Top 1.016: IN1.2 25.2,4.1 26.9,5.8 R33.1
N$12
  Top 0.61: UEXT_MALE.1 2.33,33.47 8.7,27.1 R14.1
N$13  (via drill 0.6)
  Top 0.254: 25.4,36.2 25.4,36.3 U1.16 | v63.9,40.3 63.5,39.9 61.5,39.9 60.4,38.8 57.6,38.8 56,40.4 49,40.4 48.4,39.8 36.5,39.8 35.9,39.2 26.9,39.2 25.4,37.7
  Top 0.5: 25.4,36.3 25.4,37.7
  Bottom 0.254: 79.4,69.5 80.9,68 80.9,42.5 77.2,38.8 69.9,38.8 68,40.7 64.3,40.7 v63.9,40.3
  Bottom 1.27: 79.4,69.5 EXT.1
N$14
  Top 0.61: C10.1 R9.1 55.9,30 55.9,27.5 RST.P$2
N$18
  Top 3.048: REL4.P OUT4.2
  Bottom 3.048: REL4.P OUT4.2
N$19
  Top 3.048: REL4.S 74.14,74.98 OUT4.1
  Bottom 3.048: REL4.S 74.14,73.71 | OUT4.1 74.14,74.98
N$20
  Top 0.61: R35.2 R36.2 74.7,43.6 T4.1
N$21
  Top 3.048: REL3.O 45.06,74.98 OUT3.3
  Bottom 3.048: REL3.O 45.06,73.71 | OUT3.3 45.06,74.98
N$22
  Top 0.61: T4.3 70.5,42.9 69.2,41.6 67.6,41.6 66.3,42.9 65.5,42.9 | 65.5,42.9 R37.1 | 61.3,49.2 61.3,46.9 61.6,46.6 61.6,43.4 62.5,42.5 63.2,42.5 D9.A 63.7,42.9 65.5,42.9
  Top 1.27: 61.3,49.2 62.21,50.11
  Top 1.778: 62.21,50.11 REL4.2
N$23
  Top 3.048: REL3.P OUT3.2
  Bottom 3.048: REL3.P OUT3.2
N$24
  Top 3.048: REL3.S 57,74.98 OUT3.1
  Bottom 3.048: REL3.S 57,73.71 | OUT3.1 57,74.98
N$25
  Top 0.61: T3.1 57.6,43.6 R39.2 R38.2
N$26
  Top 0.61: R37.2 65.9,45.4 67.77,43.53 O4.C
N$27
  Top 0.61: 51.2,43.6 51.1,43.5 O3.C 51.1,43.8 49.8,43.8 48.5,45.1 47.9,45.1 R40.2
N$28
  Top 0.406: 35.8,31.4 35.98,31.22 Q1.2 37.6,31.2 C12.2
  Top 0.5: U1.7 35.8,31.4
N$29
  Top 3.048: REL2.O 27.92,74.98 OUT2.3
  Bottom 3.048: REL2.O 27.92,74.98 OUT2.3
N$30  (via drill 0.6)
  Top 0.254: v65.3,39.8 64.9,39.4 61.7,39.4 60.6,38.3 57.4,38.3 55.8,39.9 49.2,39.9 48.6,39.3 36.7,39.3 36.1,38.7 27.3,38.7 26.2,37.6
  Top 0.5: U1.15 26.2,37.6
  Bottom 0.254: 81.94,70.94 81.5,70.5 81.5,42.3 77.5,38.3 69.7,38.3 68.2,39.8 v65.3,39.8
  Bottom 1.27: 81.94,70.94 EXT.2
N$31  (via drill 0.6)
  Top 0.254: v67.7,38.9 67.3,39.3 66.1,39.3 65.7,38.9 61.9,38.9 60.8,37.8 57.2,37.8 55.6,39.4 49.4,39.4 48.8,38.8 36.9,38.8 36.3,38.2 27.7,38.2 27,37.5
  Top 0.5: U1.14 27,37.5
  Bottom 0.254: 84.48,71.88 82.1,69.5 82.1,42.1 77.8,37.8 68.8,37.8 v67.7,38.9
  Bottom 1.27: 84.48,71.88 EXT.3
N$32
  Top 0.61: R41.2 R42.2 T2.1
N$33
  Top 0.61: R46.2 13.8,45.3 15.5,43.6 16.6,43.6 16.6,43.57 O1.C
N$34
  Top 0.6: 44,49.2 44,44.9 45,43.9 45,43 45.6,43
  Top 0.61: 47.9,43 45.6,43 D8.A | 47.9,43 R40.1 47.8,43.7 | T3.3 53.3,43 52.5,42.2 50.2,42.2 49.4,43 47.9,43
  Top 0.813: 44,49.2 45.1,50.3
  Top 1.27: 45.1,51.89 REL3.2
  Top 1.778: 45.1,50.3 45.1,51.89
N$35  (via drill 0.6)
  Top 0.254: v66.5,38.4 62.1,38.4 61,37.3 56.9,37.3 55.3,38.9 49.6,38.9 49,38.3 37.1,38.3 36.5,37.7 28.3,37.7 27.8,37.2
  Top 0.5: U1.13 27.8,37.2
  Bottom 0.254: 87.02,72.82 82.7,68.5 82.7,41.9 78.1,37.3 67.6,37.3 v66.5,38.4
  Bottom 1.27: 87.02,72.82 EXT.4
N$37
  Top 3.048: REL1.O 10.77,74.98 OUT1.3
  Bottom 3.048: REL1.O 10.77,74.98 OUT1.3
N$38
  Top 0.61: R44.2 R45.2 23.1,43.65 23.05,43.6 T1.1
N$39
  Top 0.61: C1.1 75.8,31.95 | 79.01,32.39 80,31.4 83.5,31.4 84.5,30.4 R4.2 C6.2 R5.1
  Top 0.813: 75.8,31.95 76.24,32.39 VR1(5V).4 79.01,32.39
N$40
  Top 0.61: O2.C 33.58,43.8 32.5,43.8 31.2,45.1 30.6,45.1 R43.2
N$43
  Top 0.61: 28.2,42.8 30.4,42.8 | T2.3 36.1,43.1 34.9,41.9 32.1,41.9 31.2,42.8 30.4,42.8 | 30.4,42.8 R43.1 | 26.6,49.1 26.6,43.5 27.3,42.8 28.2,42.8 | 28.2,42.8 D7.A
  Top 0.813: 26.6,49.1 27.9,50.4
  Top 1.27: 27.9,51.91 REL2.2
  Top 1.778: 27.9,50.4 27.9,51.91
N$44
  Top 0.61: T1.3 18.9,43 17.7,41.8 15.5,41.8 14.3,43 13.5,43 | 13.5,43 R46.1 | 11.3,43 13.5,43 | 8.8,49.6 8.8,43.9 9.7,43 11.3,43 | 11.3,43 D6.A
  Top 0.813: 8.8,49.6 9.7,50.5
  Top 1.27: 10.77,51.87 REL1.2
  Top 1.778: 10.77,51.87 10.77,51.57 9.7,50.5
N$46
  Top 0.61: R1.1 75.85,34.1
  Top 0.813: VR1(5V).3 76.29,33.66 75.85,34.1
N$47
  Top 0.61: STAT.A 60.43,28.93 R11.2
N$48
  Top 1.676: 70.6,7.3 70.3,7.6 G1.AC1
  Top 2.184: 70.6,7.3 73.7,4.2 PWR_J.- 82.27,4.2 PWR_J.--
N$50
  Top 2.184: G1.AC2 75.43,11 80.55,11 PWR_J.+
N$52
  Top 0.813: 8.83,23.13 10.3,24.6 R19.1
  Top 1.27: AIN-1.2 8.83,23.13
N$53
  Top 0.406: 32.7,32.2 33.1,32.6 40.7,32.6 42,31.3 42,31.2 | C13.2 42.6,27.5 42.6,31.2 | 42.6,31.2 Q1.1 | 42,31.2 42.6,31.2 | 42,31.2 41.8,31.2
  Top 0.5: U1.8 32.7,32.2
N$55
  Top 0.813: R25.2 8.7,3.6 8.7,9.5 6.9,11.3
  Top 1.27: AIN-2.2 6.08,12.12 6.9,11.3
N$56
  Top 0.61: C1.2 74.05,32 74.1,32.05 R1.2
N$57
  Top 0.61: R6.1 R7.1 88.4,50 86.6,48.2 VR2(3.3V).1
N$58
  Top 0.813: 7.4,18.3 R21.1
  Top 1.27: AIN-1.3 7.4,18.3
N$59
  Top 0.61: PWR_LED.C R8.1
N$60
  Top 1.016: R23.1 10.7,12 6.55,16.15
  Top 1.27: AIN-2.1 6.55,16.15
N$61  (via drill 0.6, 1)
  Top 0.61: v85,31.9 84.51,32.39
  Top 0.813: 84.51,32.39 VR1(5V).5
  Top 1.016: G1.+ 78.18,17.9 78.2,17.9 80.16,15.94 C4.+ | VR1(5V).8 83.8,36.5 v85.2,36.5 86.6,36.5 C2.1
  Bottom 0.61: 86.1,31.9 v85,31.9
  Bottom 1.016: C4.+ 86.2,17.69 86.2,23.7 87.4,24.9 87.4,28.5 86.1,29.8 86.1,31.9 86.1,35.6 v85.2,36.5
N$62
  Top 0.61: 86.1,32.6 86.4,32.6 arc180 C3.2 R2.1
  Top 0.813: VR1(5V).6 85.04,33.66 86.1,32.6
N$63
  Top 1.016: 50.8,10.8 D4.A 50.7,10.6 U5.2
  Top 1.422: U5.2 47.59,5.19 IN3.1
N$65
  Top 1.016: LED3.C 46.27,16.17 45.05,14.95 U5.1
N$66
  Top 0.61: D5.C 66.45,14.1 LED4.A 66.55,14 66.55,11.95 R27.2
N$67
  Top 1.016: D5.A 63.8,10.6 U6.2
  Top 1.422: U6.2 60.79,5.19 IN4.1
N$69
  Top 1.016: 73.31,36.2 VR1(5V).1
  Top 1.676: D1.K 73.31,36.2 72.62,36.2 L1.1
N$70
  Top 1.016: LED4.C 59.39,16.09 58.2,14.9 58.2,10.6 U6.1
N$71
  Top 0.61: D4.C 50.75,14.05 53.32,14.05 LED3.A 53.5,14.03 R29.2 53.5,12.05
N$72
  Top 1.016: U3.2 24.05,10.55 D2.A
  Top 1.27: IN1.1 20.1,4.2
  Top 1.422: U3.2 21.14,5.24 20.1,4.2
N$73
  Top 0.406: U1.26 18.9,32.2
  Top 0.5: Q2.1 15.99,32.2 U1.26
N$74
  Top 1.016: LED1.C 19.83,16.03 18.6,14.8 U3.1
N$75
  Top 0.61: D3.C 37.45,14.05 37.45,14 40.07,14 LED2.A R31.2 40.1,12.05
N$76
  Top 1.016: U4.2 37.3,10.6 D3.A
  Top 1.422: U4.2 34.29,5.09 IN2.1
N$77
  Top 0.305: U1.25 18.9,33
  Top 0.5: Q2.2 15.94,35.5 17.19,34.24 17.19,33.61 17.8,33 U1.25
N$78
  Top 1.016: 40.2,16 LED2.C 33.3,16 31.75,14.45 U4.1
N$79
  Top 0.61: D2.C 24.3,14 LED1.A
  Top 1.016: LED1.A R33.2
O1  (via drill 0.6)
  Top 0.254: v62.7,40.8 61.7,40.8 60.2,39.3 57.8,39.3 56.2,40.9 48.6,40.9 47.8,41.7 47.2,41.7 46.7,41.2 44.2,41.2 v43.8,41.6
  Top 0.406: R35.1 78.7,45.4 v79.1,45
  Top 0.5: U1.37 23,23.3 v22.9,23.2
  Bottom 0.254: 79.1,41.6 76.8,39.3 70.2,39.3 68.2,41.3 63.2,41.3 v62.7,40.8 | v22.9,23.2 22.9,23.3 29.1,23.3 30,22.4 32.3,22.4 33.2,23.3 41.3,23.3 41.6,23.6 48,23.6 50.4,26 50.4,30.4 49.5,31.3 48,31.3 45.5,33.8 45.5,39.9 v43.8,41.6
  Bottom 0.406: 79.1,41.6 v79.1,45
O2  (via drill 0.6)
  Top 0.254: R38.1 60.7,44.5 60.7,40.5 60,39.8 58,39.8 56.4,41.4 49.5,41.4 v49.02,41.88 | v21.6,22.1 22,22.5 22,23.8 22.2,24
  Top 0.5: 22.2,24 U1.36
  Bottom 0.254: v49.02,41.88 47.08,41.88 46.2,41 46.2,34 48.4,31.8 49.7,31.8 50.9,30.6 50.9,25.8 48.1,23 43.9,23 42.3,21.4 41.1,21.4 40.4,22.1 33.9,22.1 33,21.2 28,21.2 26.9,22.3 22,22.3 21.8,22.1 v21.6,22.1
O3  (via drill 0.6)
  Top 0.254: R41.1 43.4,44.3 43.4,42.5 v42.5,41.6
  Top 0.406: U1.35 21.4,23.7 v21,23.3
  Bottom 0.254: v42.5,41.6 44.9,39.2 44.9,33.4 47.5,30.8 49.2,30.8 49.9,30.1 49.9,26.2 47.8,24.1 41.4,24.1 41.1,23.8 33,23.8 32.1,22.9 30.2,22.9 29,24.1 21.8,24.1
  Bottom 0.406: v21,23.3 21.8,24.1
O4  (via drill 0.6)
  Top 0.406: U1.34 19.6,24.8 v19.1,24.3 | v13.2,39.08 13.43,39.3 17.05,39.3 v17.27,39.08 | v24.3,46.6 24.3,46.3 R44.1
  Bottom 0.305: v17.27,39.08 17.8,39.6 20,39.6 24.3,43.9
  Bottom 0.406: v19.1,24.3 19.1,24.6 11.7,32 11.7,37.58 v13.2,39.08 | 24.3,43.9 v24.3,46.6
RST  (via drill 0.6, 0.6 pad 0.25)
  Top 0.254: 92,57.5 93.9,57.5 94.5,58.1 | 94.5,58.1 94.2,57.8 | 94.5,58.1 94.5,60
  Top 0.305: v57.1,31.5 60,31.5 62.1,33.6 66.3,33.6 66.8,34.1 66.8,36.7 71.7,41.6 v71.7,42.3 | v73.5,46.9 78,51.4 78,57.7 79.7,59.4 90.1,59.4 92,57.5 | JTAG.6 95.8,61.3 94.5,60
  Top 0.406: 31.9,29 v32.7,28.2 | v48.5,29.9 53.1,29.9 v53.2,29.8
  Top 0.5: U1.4 31.9,29
  Top 0.61: U2.1 48.7,21.1 49.8,20 51.45,20 53.25,21.8 R10.2 53.6,22.2 C11.1 v52.27,23.9 | v57.1,31.5 56.5,31.5 55.2,32.8 R9.2
  Bottom 0.254: 94.5,60.02 86.72,60.02 | AVRISP.5 93.4,19.2
  Bottom 0.305: v71.7,42.3 73.5,44.1 v73.5,46.9
  Bottom 0.406: 86.72,60.02 85.7,59 85.7,43.2 87.3,41.6 87.3,30 88.6,28.7 88.6,24.6 87.4,23.4 87.4,21.1 87.7,20.8 91.1,20.8 | v32.7,28.2 46.8,28.2 v48.5,29.9
  Bottom 0.61: v52.27,23.9 53.2,24.82 v53.2,29.8 53.7,30.3 55.9,30.3 v57.1,31.5
  Bottom 0.813: JTAG.6 94.5,60.02
  Bottom 1.016: AVRISP.5 92.7,19.2 91.1,20.8
RXD  (via drill 0.6)
  Top 0.254: v33.3,34.1 33.7,34.5 46,34.5 46.8,33.7 v49.2,33.7
  Top 0.406: v33.3,34.1 32.2,33 | UEXT_MALE.3 2.49,37.3 15,37.3 v15.2,37.5 | v59.4,34.6 v64.1,34.6
  Top 0.5: 32.2,33 U1.9
  Top 0.61: UEXT_FEMALE.3 95.65,37.45 v95.1,38 | v92,35.6 90.8,36.8 90.8,38.1 88.3,40.6 v86.3,40.6
  Bottom 0.254: v33.3,34.1 32.3,33.1 31.6,33.1 29.1,35.6 19.4,35.6 18.1,36.9 15.8,36.9 v15.2,37.5 | 64.4,34.3 67.9,34.3 68.4,34.8 79.8,34.8
  Bottom 0.305: v64.1,34.6 64.4,34.3 | 79.8,34.8 84,39 85.7,39 86.3,39.6 v86.3,40.6
  Bottom 0.406: v49.2,33.7 49.2,38.7 50,39.5 54.5,39.5 v59.4,34.6
  Bottom 0.61: v95.1,38 94.9,38.2 92.8,38.2 92,37.4 v92,35.6
SCK  (via drill 0.6)
  Top 0.254: 31.4,28.2 32.7,26.9 v32.7,26.7 | UEXT_MALE.9 3.01,44.4 6.91,44.4 10.21,41.1 18,41.1 19.6,42.7 24.7,42.7 26.3,41.1 35.1,41.1 36.5,42.5 39.3,42.5 v40.2,41.6
  Top 0.406: 90.88,16.65 90.9,16.65 90.9,16.7 89.7,16.7 88.3,18.1 88.3,21.8 | v49,28.7 v54.3,28.7 | v84.9,21.8 88.3,21.8 | 88.3,21.8 v88.4,21.9
  Top 0.5: 31.4,28.2 U1.3
  Top 0.61: v90.6,46.6 95.3,46.6 96.8,45.1 97.8,45.1 97.8,45.07 UEXT_FEMALE.9
  Top 0.813: AVRISP.7 90.88,16.65
  Bottom 0.254: v40.2,41.6 40.2,35.3 38.9,34 37.1,34 31.6,28.5 31.6,27.8 v32.7,26.7
  Bottom 0.406: v88.4,21.9 88.4,23.3 89.5,24.4 89.5,28.8 88.1,30.2 88.1,41.2 90.6,43.7 v90.6,46.6 | v32.7,26.7 38.9,26.7 39.3,27.1 41,27.1 41.4,26.7 47,26.7 v49,28.7 | v54.3,28.7 56.8,26.2 58.1,26.2 61.4,22.9 82.4,22.9 83.5,21.8 v84.9,21.8
SCL  (via drill 0.6)
  Top 0.305: 9.6,40 18.6,40
  Top 0.406: 93.7,38.2 R15.1 93.7,38.38 | UEXT_MALE.5 3.7,40 5.4,41.7 7.9,41.7 9.6,40 | 18.6,40 18.9,40.3 21.1,40.3 v22.3,39.1 22.3,38.9 23,38.2 | v92.3,32.3 88,28 v86.1,28
  Top 0.5: 23,38.2 U1.19
  Top 0.55: UEXT_FEMALE.5 97.16,39.45 94.78,39.45 93.7,38.38 v93.7,37
  Bottom 0.406: v22.3,39.1 32.1,39.1 37.3,44.3 53.2,44.3 62.9,34.6 62.9,34.1 69.1,27.9 86,27.9 v86.1,28 | v92.3,32.3 93,33 93,36.3 v93.7,37
SDA  (via drill 0.6)
  Top 0.305: 17.7,38.1 19.2,39.6 20.4,39.6 21.7,38.3 21.7,38.1
  Top 0.406: v5.4,39.4 6.8,38 13.8,38 14.4,38.6 15.8,38.6 16.3,38.1 17.7,38.1 | 21.7,38.1 v21.9,37.9
  Top 0.5: v21.9,37.9 22.2,37.6 U1.20
  Top 0.61: v95.1,40.5 94.1,40.5 R17.1 | v92.1,30.6 88.2,26.7 v86,26.7
  Bottom 0.406: UEXT_MALE.6 3.6,40 4.2,39.4 v5.4,39.4 | v21.9,37.9 32.2,37.9 37.9,43.6 52.9,43.6 62,34.5 62,33.9 68.8,27.1 85.3,27.1 85.7,26.7 v86,26.7 | v95.1,40.5 92,40.5 91,39.5 91,31.7 v92.1,30.6
  Bottom 0.61: v95.1,40.5 97.18,40.5 UEXT_FEMALE.6
TCK  (via drill 0.6)
  Top 0.254: v63,37.5 62.3,36.8 56.7,36.8 56,37.5 51.8,37.5 51.3,37 50.2,37 49.9,37.3 37.5,37.3 36.9,36.7 30.48,36.7 28.27,34.5 21.9,34.5 21.4,35
  Top 0.5: 21.4,35 U1.21
  Bottom 0.254: 84.7,65.4 83.3,64 83.3,41.7 78.4,36.8 66.8,36.8 65.6,38 63.5,38 v63,37.5
  Bottom 1.27: JTAG.1 85.68,66.38 84.7,65.4
TDI  (via drill 0.6)
  Top 0.5: U1.24 20.12,33.8 20.3,33.98 20.3,34.9 19.5,35.7 v19.5,38.6
  Top 1.27: JTAG.9 90.28,56.22 88.8,57.7 v79.9,57.7
  Bottom 0.254: v19.5,38.6 19.75,38.6 21.85,40.7 23,40.7 23.3,40.4 31.2,40.4 36.4,45.6 53.9,45.6 57.9,41.6 61.2,41.6 61.4,41.8 68.5,41.8 70.5,39.8 76.5,39.8 78.1,41.4 78.1,45.5 80.3,47.7 80.3,50.5 79.9,50.9 v79.9,57.7
TDO  (via drill 0.6)
  Top 0.254: v64.3,37 63.6,36.3 56.5,36.3 55.8,37 52,37 51.5,36.5 49.9,36.5 49.7,36.7 38.2,36.7 v37.9,36.4
  Top 0.5: U1.23 18.4,34.6 18.05,34.95 v18.05,35.65
  Bottom 0.254: 86,63.2 84,61.2 84,41.6 78.7,36.3 66.6,36.3 65.8,37.1 64.4,37.1 v64.3,37
  Bottom 0.305: v18.05,35.65 18.7,35 28.7,35 31.4,32.3 32.8,32.3 36.9,36.4 v37.9,36.4
  Bottom 1.27: JTAG.3 86.64,63.84 86,63.2
TMS  (via drill 0.6)
  Top 0.5: U1.22 v20.6,37.9
  Bottom 0.254: 87.1,61.3 86,61.3 84.6,59.9 84.6,41.4 79,35.8 66.3,35.8 66,36.1 62.4,36.1
  Bottom 0.305: v20.6,37.9 20.6,38.7 22,40.1 22.7,40.1 23,39.8 31.7,39.8 36.9,45
  Bottom 0.406: 36.9,45 53.5,45 62.4,36.1
  Bottom 1.27: 87.1,61.3 JTAG.5
TXD  (via drill 0.6)
  Top 0.254: v31.95,34.15 32.8,35 46.3,35 46.7,34.6 50,34.6 v50.3,34.9 | v65.6,35.2 65.3,35.5 57.8,35.5 v57.4,35.1 | v84.9,40.1 85.3,40.1 85.7,39.7 88.1,39.7 90.1,37.7 90.1,36.1 91.6,34.6 93.8,34.6 v94,34.8
  Top 0.305: v31.95,34.15 31.6,33.8
  Top 0.5: 31.6,33.8 U1.10
  Bottom 0.254: v50.3,34.9 49.9,35.3 49.9,38.4 50.4,38.9 53.6,38.9 v57.4,35.1 | v65.6,35.2 65.7,35.3 79.4,35.3 84.2,40.1 v84.9,40.1 | UEXT_FEMALE.4 97.7,37.5 97.6,37.4
  Bottom 0.305: 29.9,36.2 19.6,36.2 18.35,37.45 16.75,37.45 14,40.2 9.9,40.2 9.85,40.15
  Bottom 0.406: 29.9,36.2 v31.95,34.15 | UEXT_MALE.4 2.4,37.46 2.4,37.5 2.9,38 7.7,38 9.85,40.15 | v94,34.8 96.6,37.4 97.6,37.4
VCC  (via drill 0.6)
  Top 0.254: C16.1 23.8,22.7 23.8,23.9
  Top 0.5: 20,31.4 U1.27 | 20.1,29.8 U1.29 16,29.8 | 23.8,23.9 U1.38
  Top 0.508: 34,27.5 34,28.6 33.4,29.2 33.1,29.2 32.5,29.8 U1.5
  Top 0.55: C17.1 25.3,39.2 24.6,38.5 U1.17
  Top 0.61: VR2(3.3V).2 83.41,46.89 | VR2(3.3V).2 83.41,48.1 83.4,48.1 83.41,48.09 VR2(3.3V).4 | C9.+ R7.2 | R15.2 92,37.2 93.3,35.9 94.7,35.9 95.2,35.4 95.2,32.5 95.8,31.9 R16.2 95.8,24.2 95.77,24.2 AVRISP.2 98.2,21.85 98.2,11.9 93.95,7.65 | v17.2,23.1 19.6,23.1 20.3,22.4 R34.2 21.3,20.9 22,20.9 C16.1 | 25.3,39.2 26,39.9 35.6,39.9 36.2,40.5 47.3,40.5 v47.5,40.7 | C8.2 81.5,53.4 C9.+ | VR2(3.3V).2 83.3,48.2 83.8,48.7 C9.+ | 93.95,7.65 91.6,5.3 91.6,3.5 PWR_LED.A | v91.3,10.3 93.95,7.65 | v56.2,22 56.2,21.8 | 20,31.4 20.5,30.9 20.5,30.2 20.1,29.8 | 13.7,27.5 16,29.8
  Top 0.813: 12.5,27.5 R14.2 12.5,26.6 11.8,25.9 6.8,25.9 | 12.5,27.5 C15.2 C14.1 | 92,42 R17.2 R15.2 | 92,42 91.7,42 | 92,42 R18.2 v92,45.4 | 34,27.5 C18.1 34.1,25.6 33.4,24.9 R32.2 34.1,21.2 v34.6,21.2 | R30.2 43.15,20.65 v43.1,20.6 | v13.8,27.4 13.7,27.5 12.5,27.5 | R12.1 51.35,34.15 v51,33.8
  Top 1.016: U2.2 51.52,21.7 v51.83,22 | R10.1 56.2,21.8 R28.2
  Top 1.27: EXT.5 89.56,62.43 JTAG.7 | 91.7,42 VR2(3.3V).4 | AIN-1.1 6.8,25.9
  Bottom 0.61: v43.1,20.6 44.5,22 50.6,22 | 50.6,22 v51.83,22 v56.2,22 56.23,21.97 76.13,21.97 83.6,14.5 87.1,14.5 v91.3,10.3 | 50.6,22 50.6,24.5 51.6,25.5 51.6,31.95 51,32.55 | 51,32.55 v51,33.8 | 51,32.55 48.75,32.55 47.5,33.8 v47.5,40.7
  Bottom 0.813: JTAG.4 97.26,63.84 98.1,63 98.1,62.6 | 98.1,62.6 98.1,51.5 v92,45.4 | 91,74.2 98.1,67.1 98.1,62.6 | v43.1,20.6 40.6,20.6 40,21.2 v34.6,21.2 33.4,20 25.4,20 25.2,20.2 23.9,20.2 23.3,19.6 17.2,19.6 16,20.8 16,23.1 | 16,23.1 16,25.2 v13.8,27.4 | 16,23.1 v17.2,23.1
  Bottom 1.778: EXT.5 89.56,75.64 91,74.2

### Text on the board
Bottom: NC | COM | NO | NC | COM | NO | NC | COM | NO | NC | COM | NO | - | + | - | + | - | + | - | +
tNames: WWW.OLIMEX.COM/DEV | COPYRIGHT(C) 2009 | MOD-IO Rev.A | + | 3.3V | + | 1.2 | 1.3 | 2.1 | + | 2.2 | AGND | 8-30VDC | 6-20VAC
bStop: PD7 | PD6 | PD5 | PD4 | 3.3V | GND | COPYRIGHT(C) 2009 | WWW.OLIMEX.COM/DEV